# EAGLE schematic Utable_epaper_32seg_rev2 (EAGLE 6.5.0)
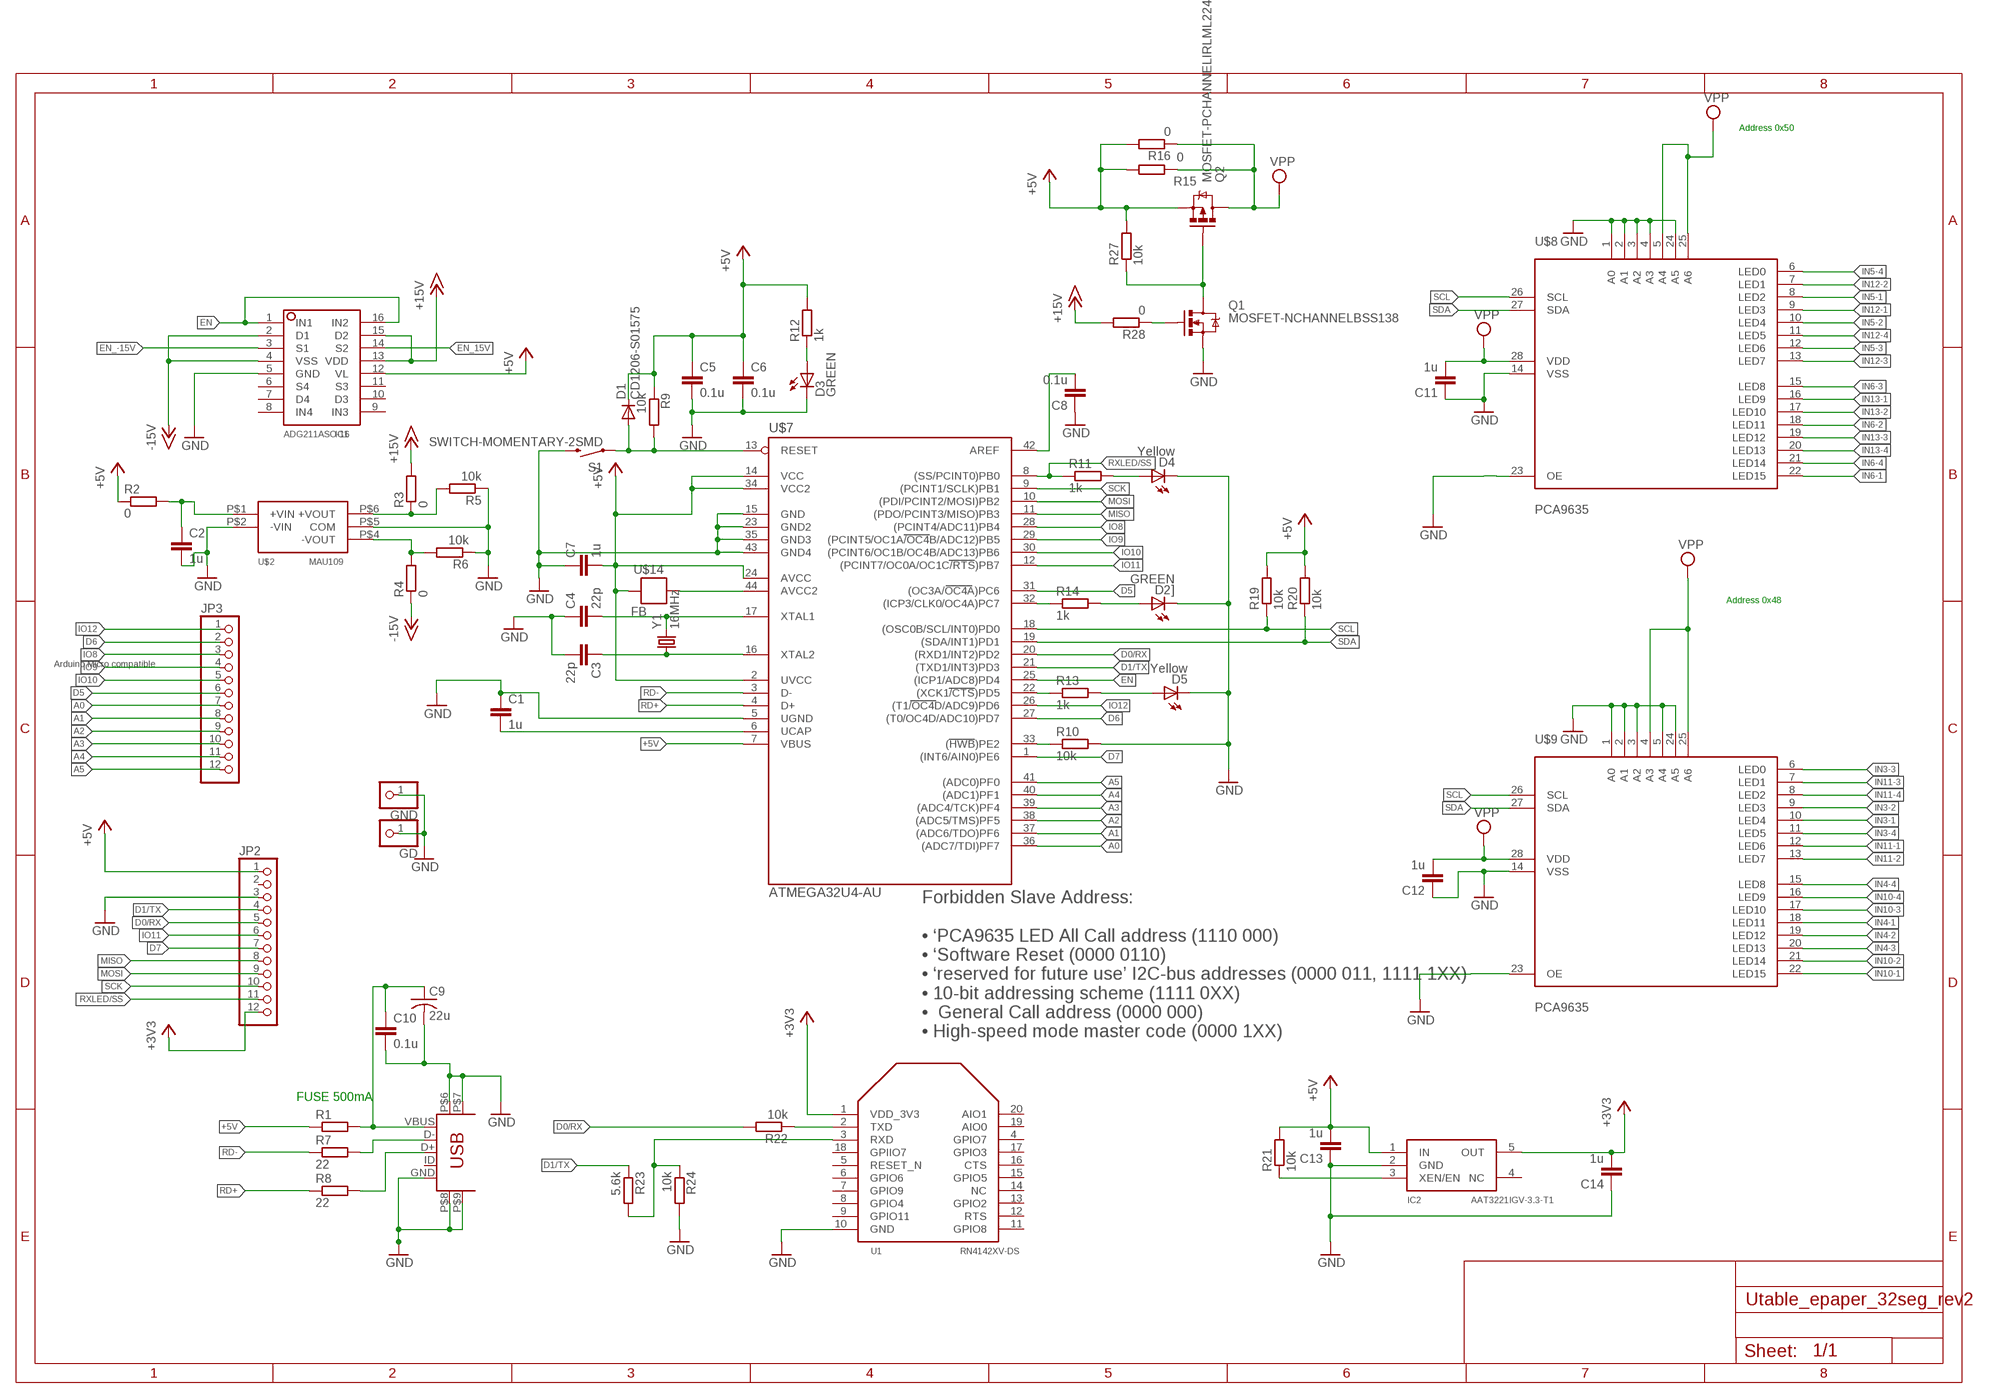
[diagram p0: schematic, sheet 1, part 1 of 2]
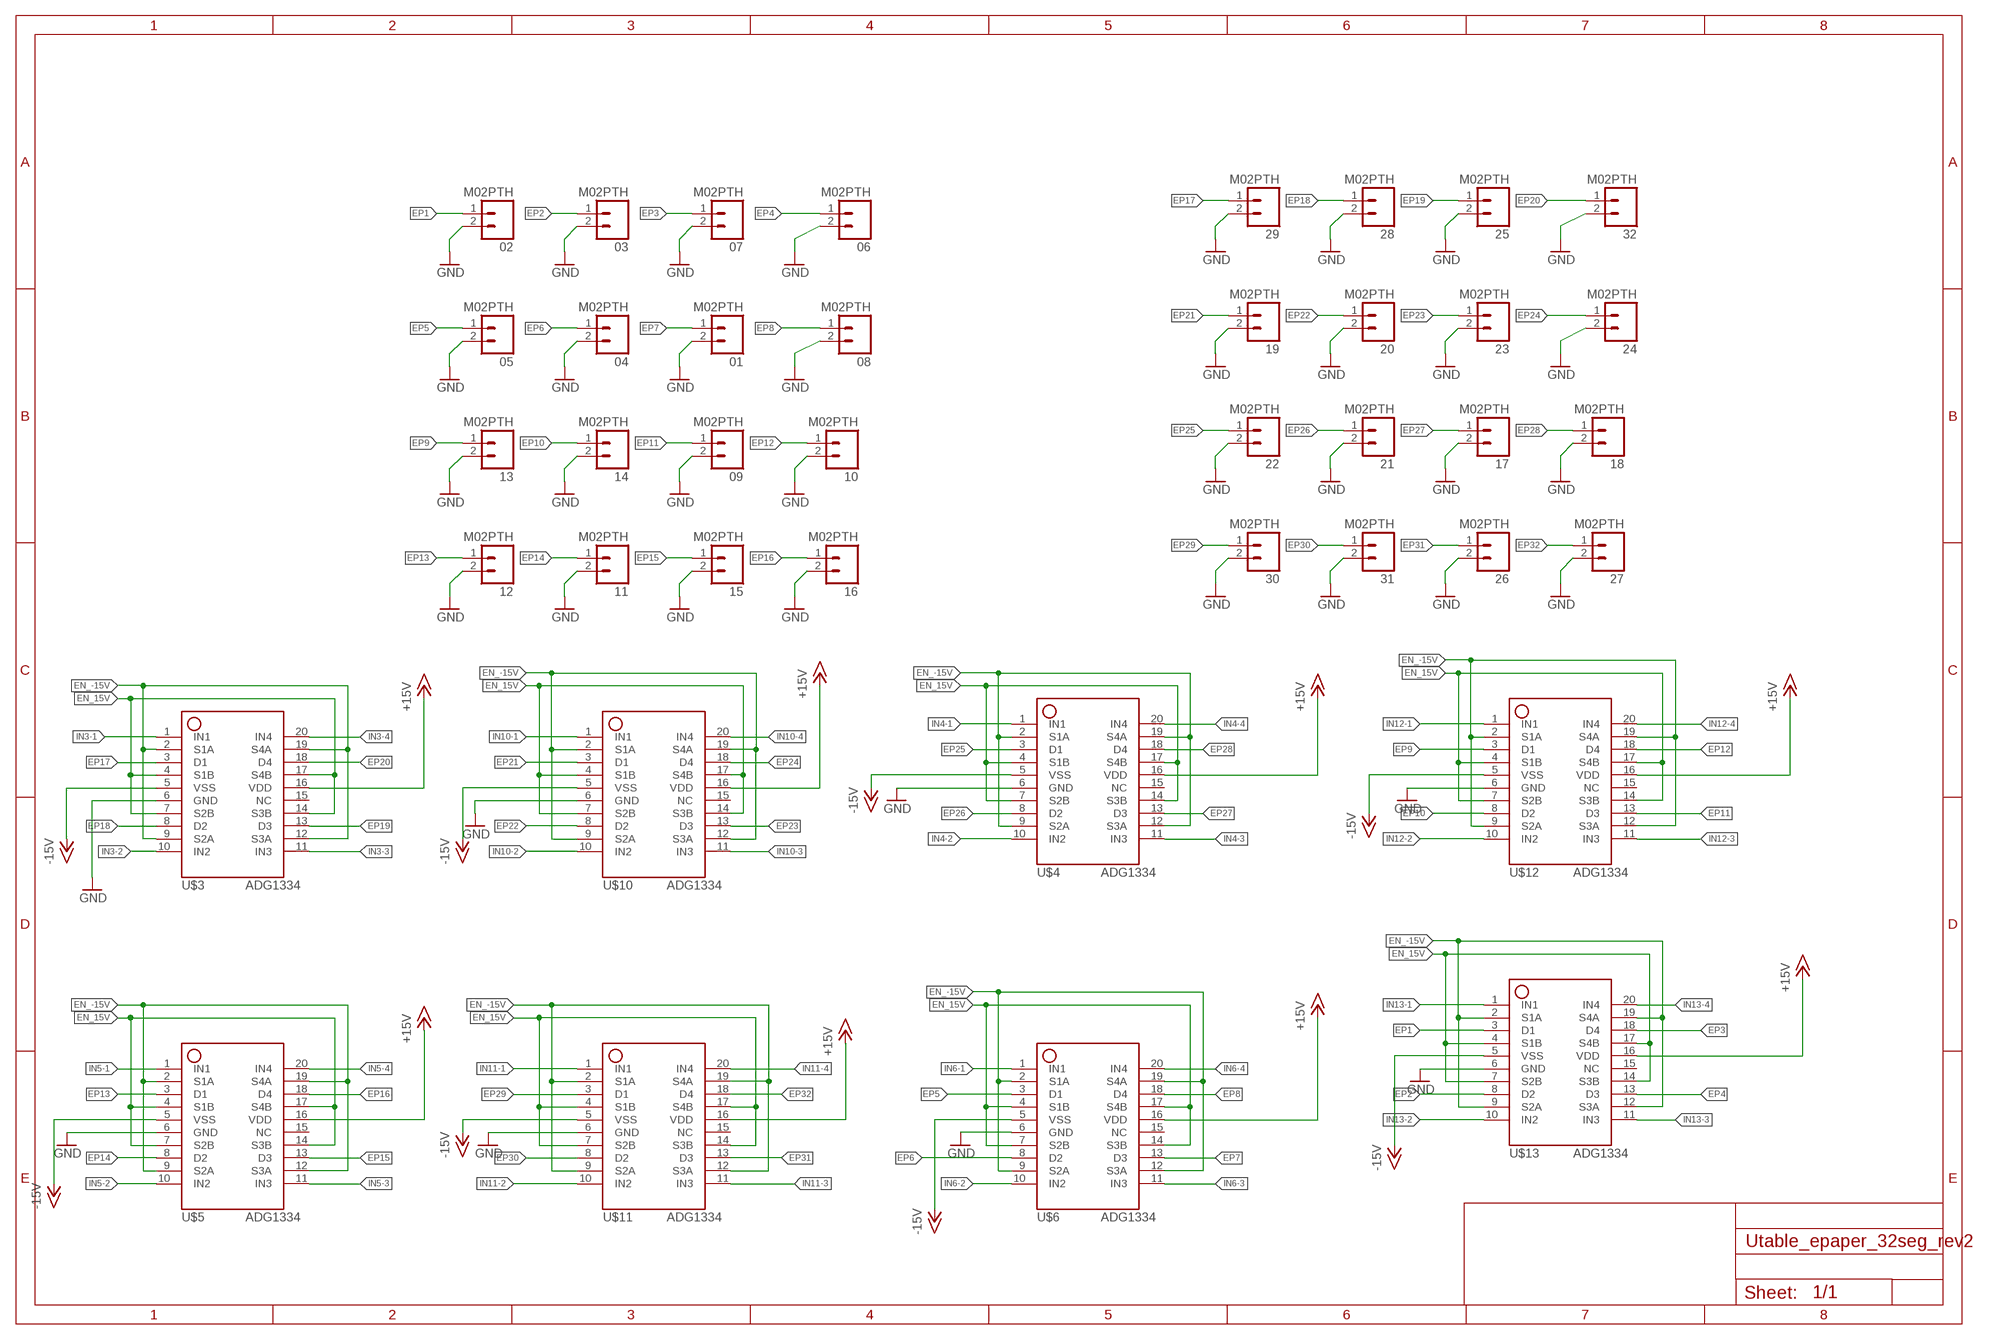
[diagram p1: schematic, sheet 1, part 2 of 2]

## Parts
01  M02PTH  [1X02]
02  M02PTH  [1X02]
03  M02PTH  [1X02]
04  M02PTH  [1X02]
05  M02PTH  [1X02]
06  M02PTH  [1X02]
07  M02PTH  [1X02]
08  M02PTH  [1X02]
09  M02PTH  [1X02]
10  M02PTH  [1X02]
11  M02PTH  [1X02]
12  M02PTH  [1X02]
13  M02PTH  [1X02]
14  M02PTH  [1X02]
15  M02PTH  [1X02]
16  M02PTH  [1X02]
17  M02PTH  [1X02]
18  M02PTH  [1X02]
19  M02PTH  [1X02]
20  M02PTH  [1X02]
21  M02PTH  [1X02]
22  M02PTH  [1X02]
23  M02PTH  [1X02]
24  M02PTH  [1X02]
25  M02PTH  [1X02]
26  M02PTH  [1X02]
27  M02PTH  [1X02]
28  M02PTH  [1X02]
29  M02PTH  [1X02]
30  M02PTH  [1X02]
31  M02PTH  [1X02]
32  M02PTH  [1X02]
C1  1u  C-EUC0603K  [C0603K]
C2  1u  C-EUC0603  [C0603]
C3  22p  C-EUC0603K  [C0603K]
C4  22p  C-EUC0603K  [C0603K]
C5  0.1u  C-EUC0603K  [C0603K]
C6  0.1u  C-EUC0603K  [C0603K]
C7  1u  C-EUC0603K  [C0603K]
C8  0.1u  C-EUC0603K  [C0603K]
C9  22u  C-USC0805K  [C0805K]
C10  0.1u  C-EUC0603K  [C0603K]
C11  1u  C-EUC0603K  [C0603K]
C12  1u  C-EUC0603K  [C0603K]
C13  1u  C-EUC0603K  [C0603K]
C14  1u  C-EUC0603K  [C0603K]
D1  CD1206-S01575  [1206]
D2]  GREEN  LED-GREEN0603  [LED-0603]
D3  GREEN  LED-GREEN0603  [LED-0603]
D4  Yellow  LED-YELLOW0603  [LED-0603]
D5  Yellow  LED-YELLOW0603  [LED-0603]
GD  PINHD-1X1  [1X01]
GND  PINHD-1X1  [1X01]
IC1  ADG211ASO-16  [SO-16]
IC2  AAT3221IGV-3.3-T1  [SOT23-5]
JP2  PINHD-1X12  [1X12]
JP3  PINHD-1X12  [1X12]
Q1  MOSFET-NCHANNELBSS138  [SOT23]
Q2  MOSFET-PCHANNELIRLML2244  [SOT23-3]
R1  R-EU_R0603  [R0603]
R2  0  R-EU_R0603  [R0603]
R3  0  R-EU_R0603  [R0603]
R4  0  R-EU_R0603  [R0603]
R5  10k  R-EU_R0603  [R0603]
R6  10k  R-EU_R0603  [R0603]
R7  22  R-EU_R0603  [R0603]
R8  22  R-EU_R0603  [R0603]
R9  10k  R-EU_R0603  [R0603]
R10  10k  R-EU_R0603  [R0603]
R11  1k  R-EU_R0603  [R0603]
R12  1k  R-EU_R0603  [R0603]
R13  1k  R-EU_R0603  [R0603]
R14  1k  R-EU_R0603  [R0603]
R15  0  R-EU_R0603  [R0603]
R16  0  R-EU_R0603  [R0603]
R19  10k  R-EU_R0603  [R0603]
R20  10k  R-EU_R0603  [R0603]
R21  10k  R-EU_R0603  [R0603]
R22  10k  R-EU_R0603  [R0603]
R23  5.6k  R-EU_R0603  [R0603]
R24  10k  R-EU_R0603  [R0603]
R27  10k  R-EU_R0603  [R0603]
R28  0  R-EU_R0603  [R0603]
S1  SWITCH-MOMENTARY-2SMD  [TACTILE-SWITCH-SMD]
U1  RN4142XV-DS  [XBEE]
U$1  USB_MICRO_FCI  [USB_MICRO_FCI]
U$2  MAU109  [MAU109]
U$3  ADG1334  [SSOP20]
U$4  ADG1334  [SSOP20]
U$5  ADG1334  [SSOP20]
U$6  ADG1334  [SSOP20]
U$7  ATMEGA32U4-AU  [TQFP44]
U$8  PCA9635  [PCA9635]
U$9  PCA9635  [PCA9635]
U$10  ADG1334  [SSOP20]
U$11  ADG1334  [SSOP20]
U$12  ADG1334  [SSOP20]
U$13  ADG1334  [SSOP20]
U$14  FB  [0603]
Y1  16MHz  403C11E16M00000  [OSCILLATOR-3225]

## Nets
+3V3: C14.2 IC2.5(OUT) JP2.12 U1.1(VDD_3V3)
+5V: C5.1 C6.1 C7.2 C13.2 D1.2(C) IC1.12(VL) IC2.1(IN) JP2.1 Q2.2(S) R1.1 R2.1 R9.1 R12.2 R15.2 R16.2 R19.2 R20.2 R21.2 R27.2 U$7.2(UVCC) U$7.7(VBUS) U$7.14(VCC) U$7.24(AVCC) U$7.34(VCC2) U$14.2
+15V: IC1.13(VDD) IC1.15(D2) R3.2 R28.2 U$3.16(VDD) U$4.16(VDD) U$5.16(VDD) U$6.16(VDD) U$10.16(VDD) U$11.16(VDD) U$12.16(VDD) U$13.16(VDD)
-15V: IC1.2(D1) IC1.4(VSS) R4.1 U$3.5(VSS) U$4.5(VSS) U$5.5(VSS) U$6.5(VSS) U$10.5(VSS) U$11.5(VSS) U$12.5(VSS) U$13.5(VSS)
A0: JP3.7 U$7.36((ADC7/TDI)PF7)
A1: JP3.8 U$7.37((ADC6/TDO)PF6)
A2: JP3.9 U$7.38((ADC5/TMS)PF5)
A3: JP3.10 U$7.39((ADC4/TCK)PF4)
A4: JP3.11 U$7.40((ADC1)PF1)
A5: JP3.12 U$7.41((ADC0)PF0)
D0/RX: JP2.5 R22.2 U$7.20((RXD1/INT2)PD2)
D1/TX: JP2.4 R23.1 U$7.21((TXD1/INT3)PD3)
D5: JP3.6 U$7.31((OC3A/OC4A)PC6)
D6: JP3.2 U$7.27((T0/OC4D/ADC10)PD7)
D7: JP2.7 U$7.1((INT6/AIN0)PE6)
EN: IC1.1(IN1) IC1.16(IN2) U$7.25((ICP1/ADC8)PD4)
EN_15V: IC1.14(S2) U$3.4(S1B) U$3.7(S2B) U$3.14(S3B) U$3.17(S4B) U$4.4(S1B) U$4.7(S2B) U$4.14(S3B) U$4.17(S4B) U$5.4(S1B) U$5.7(S2B) U$5.14(S3B) U$5.17(S4B) U$6.4(S1B) U$6.7(S2B) U$6.14(S3B) U$6.17(S4B) U$10.4(S1B) U$10.7(S2B) U$10.14(S3B) U$10.17(S4B) U$11.4(S1B) U$11.7(S2B) U$11.14(S3B) U$11.17(S4B) U$12.4(S1B) U$12.7(S2B) U$12.14(S3B) U$12.17(S4B) U$13.4(S1B) U$13.7(S2B) U$13.14(S3B) U$13.17(S4B)
EN_-15V: IC1.3(S1) U$3.2(S1A) U$3.9(S2A) U$3.12(S3A) U$3.19(S4A) U$4.2(S1A) U$4.9(S2A) U$4.12(S3A) U$4.19(S4A) U$5.2(S1A) U$5.9(S2A) U$5.12(S3A) U$5.19(S4A) U$6.2(S1A) U$6.9(S2A) U$6.12(S3A) U$6.19(S4A) U$10.2(S1A) U$10.9(S2A) U$10.12(S3A) U$10.19(S4A) U$11.2(S1A) U$11.9(S2A) U$11.12(S3A) U$11.19(S4A) U$12.2(S1A) U$12.9(S2A) U$12.12(S3A) U$12.19(S4A) U$13.2(S1A) U$13.9(S2A) U$13.12(S3A) U$13.19(S4A)
EP1: 02.1 U$13.3(D1)
EP2: 03.1 U$13.8(D2)
EP3: 07.1 U$13.18(D4)
EP4: 06.1 U$13.13(D3)
EP5: 05.1 U$6.3(D1)
EP6: 04.1 U$6.8(D2)
EP7: 01.1 U$6.13(D3)
EP8: 08.1 U$6.18(D4)
EP9: 13.1 U$12.3(D1)
EP10: 14.1 U$12.8(D2)
EP11: 09.1 U$12.13(D3)
EP12: 10.1 U$12.18(D4)
EP13: 12.1 U$5.3(D1)
EP14: 11.1 U$5.8(D2)
EP15: 15.1 U$5.13(D3)
EP16: 16.1 U$5.18(D4)
EP17: 29.1 U$3.3(D1)
EP18: 28.1 U$3.8(D2)
EP19: 25.1 U$3.13(D3)
EP20: 32.1 U$3.18(D4)
EP21: 19.1 U$10.3(D1)
EP22: 20.1 U$10.8(D2)
EP23: 23.1 U$10.13(D3)
EP24: 24.1 U$10.18(D4)
EP25: 22.1 U$4.3(D1)
EP26: 21.1 U$4.8(D2)
EP27: 17.1 U$4.13(D3)
EP28: 18.1 U$4.18(D4)
EP29: 30.1 U$11.3(D1)
EP30: 31.1 U$11.8(D2)
EP31: 26.1 U$11.13(D3)
EP32: 27.1 U$11.18(D4)
GND: 01.2 02.2 03.2 04.2 05.2 06.2 07.2 08.2 09.2 10.2 11.2 12.2 13.2 14.2 15.2 16.2 17.2 18.2 19.2 20.2 21.2 22.2 23.2 24.2 25.2 26.2 27.2 28.2 29.2 30.2 31.2 32.2 C1.1 C2.2 C3.2 C4.1 C5.2 C6.2 C7.1 C8.1 C9.2 C10.2 C11.1 C12.1 C13.1 C14.1 D2].C D3.C D4.C D5.C GD.1 GND.1 IC1.5(GND) IC2.2(GND) JP2.3 Q1.2(S) R5.1 R6.1 R10.2 R24.2 S1.3 U1.10(GND) U$1.GND U$1.P$6(MTN1) U$1.P$7(MTN2) U$1.P$8(MTN3) U$1.P$9(MTN4) U$2.P$2(-VIN) U$2.P$5(COM) U$3.6(GND) U$4.6(GND) U$5.6(GND) U$6.6(GND) U$7.5(UGND) U$7.15(GND) U$7.23(GND2) U$7.35(GND3) U$7.43(GND4) U$8.1(A0) U$8.2(A1) U$8.3(A2) U$8.4(A3) U$8.14(VSS) U$8.23(OE) U$8.24(A5) U$9.1(A0) U$9.2(A1) U$9.3(A2) U$9.5(A4) U$9.14(VSS) U$9.23(OE) U$9.24(A5) U$10.6(GND) U$11.6(GND) U$12.6(GND) U$13.6(GND)
IN3-1: U$3.1(IN1) U$9.10(LED4)
IN3-2: U$3.10(IN2) U$9.9(LED3)
IN3-3: U$3.11(IN3) U$9.6(LED0)
IN3-4: U$3.20(IN4) U$9.11(LED5)
IN4-1: U$4.1(IN1) U$9.18(LED11)
IN4-2: U$4.10(IN2) U$9.19(LED12)
IN4-3: U$4.11(IN3) U$9.20(LED13)
IN4-4: U$4.20(IN4) U$9.15(LED8)
IN5-1: U$5.1(IN1) U$8.8(LED2)
IN5-2: U$5.10(IN2) U$8.10(LED4)
IN5-3: U$5.11(IN3) U$8.12(LED6)
IN5-4: U$5.20(IN4) U$8.6(LED0)
IN6-1: U$6.1(IN1) U$8.22(LED15)
IN6-2: U$6.10(IN2) U$8.18(LED11)
IN6-3: U$6.11(IN3) U$8.15(LED8)
IN6-4: U$6.20(IN4) U$8.21(LED14)
IN10-1: U$9.22(LED15) U$10.1(IN1)
IN10-2: U$9.21(LED14) U$10.10(IN2)
IN10-3: U$9.17(LED10) U$10.11(IN3)
IN10-4: U$9.16(LED9) U$10.20(IN4)
IN11-1: U$9.12(LED6) U$11.1(IN1)
IN11-2: U$9.13(LED7) U$11.10(IN2)
IN11-3: U$9.7(LED1) U$11.11(IN3)
IN11-4: U$9.8(LED2) U$11.20(IN4)
IN12-1: U$8.9(LED3) U$12.1(IN1)
IN12-2: U$8.7(LED1) U$12.10(IN2)
IN12-3: U$8.13(LED7) U$12.11(IN3)
IN12-4: U$8.11(LED5) U$12.20(IN4)
IN13-1: U$8.16(LED9) U$13.1(IN1)
IN13-2: U$8.17(LED10) U$13.10(IN2)
IN13-3: U$8.19(LED12) U$13.11(IN3)
IN13-4: U$8.20(LED13) U$13.20(IN4)
IO8: JP3.3 U$7.28((PCINT4/ADC11)PB4)
IO9: JP3.4 U$7.29((PCINT5/OC1A/OC4B/ADC12)PB5)
IO10: JP3.5 U$7.30((PCINT6/OC1B/OC4B/ADC13)PB6)
IO11: JP2.6 U$7.12((PCINT7/OC0A/OC1C/RTS)PB7)
IO12: JP3.1 U$7.26((T1/OC4D/ADC9)PD6)
MISO: JP2.8 U$7.11((PDO/PCINT3/MISO)PB3)
MOSI: JP2.9 U$7.10((PDI/PCINT2/MOSI)PB2)
N$1: C9.1 C10.1 R1.2 U$1.VBUS
N$2: C4.2 U$7.17(XTAL1) Y1.P$3
N$3: R7.2 U$1.D-
N$4: R8.2 U$1.D+
N$5: C2.1 R2.2 U$2.P$1(+VIN)
N$6: R3.1 R5.2 U$2.P$6(+VOUT)
N$7: R4.2 R6.2 U$2.P$4(-VOUT)
N$8: C3.1 U$7.16(XTAL2) Y1.P$1
N$9: D1.1(A) R9.2 S1.1 U$7.13(RESET)
N$10: C1.2 U$7.6(UCAP)
N$12: C8.2 U$7.42(AREF)
N$13: D5.A R13.2
N$14: U$7.44(AVCC2) U$14.1
N$15: R13.1 U$7.22((XCK1/CTS)PD5)
N$16: R14.1 U$7.32((ICP3/CLK0/OC4A)PC7)
N$17: D2].A R14.2
N$19: D4.A R11.2
N$20: D3.A R12.1
N$21: R10.1 U$7.33((HWB)PE2)
N$26: R22.1 U1.2(TXD)
N$27: IC2.3(XEN/EN) R21.1
N$28: R23.2 R24.1 U1.3(RXD)
N$29: Q1.3(D) Q2.1(G) R27.1
N$30: Q1.1(G) R28.1
RD+: R8.1 U$7.4(D+)
RD-: R7.1 U$7.3(D-)
RXLED/SS: JP2.11 R11.1 U$7.8((SS/PCINT0)PB0)
SCK: JP2.10 U$7.9((PCINT1/SCLK)PB1)
SCL: R19.1 U$7.18((OSC0B/SCL/INT0)PD0) U$8.26(SCL) U$9.26(SCL)
SDA: R20.1 U$7.19((SDA/INT1)PD1) U$8.27(SDA) U$9.27(SDA)
VPP: C11.2 C12.2 Q2.3(D) R15.1 R16.1 U$8.5(A4) U$8.25(A6) U$8.28(VDD) U$9.4(A3) U$9.25(A6) U$9.28(VDD)
Unconnected: IC1.6(S4) IC1.7(D4) IC1.8(IN4) IC1.9(IN3) IC1.10(D3) IC1.11(S3) IC2.4(NC) JP2.2 U1.4(GPIO7) U1.5(RESET_N) U1.6(GPIO6) U1.7(GPIO9) U1.8(GPIO4) U1.9(GPIO11) U1.11(GPIO8) U1.12(RTS) U1.13(GPIO2) U1.14(NC) U1.15(GPIO5) U1.16(CTS) U1.17(GPIO3) U1.18(GPIIO7) U1.19(AIO0) U1.20(AIO1) U$1.ID U$3.15(NC) U$4.15(NC) U$5.15(NC) U$6.15(NC) U$10.15(NC) U$11.15(NC) U$12.15(NC) U$13.15(NC)

## Notes on the sheet
- Address 0x50
- Address 0x48
- Arduino Micro compatible
- Forbidden Slave Address:
  
  • ‘PCA9635 LED All Call address (1110 000) 
  • ‘Software Reset (0000 0110) 
  • ‘reserved for future use’ I2C-bus addresses (0000 011, 1111 1XX)
  • 10-bit addressing scheme (1111 0XX)
  •  General Call address (0000 000)
  • High-speed mode master code (0000 1XX)
- FUSE 500mA

## Library data of the parts
01-09 10-32 = SparkFun-Connectors:M02: Standard 2-pin 0.1" header. Use with - straight break away headers ( PRT-00116) - right angle break away headers (PRT-00553) - swiss pins (PRT-00743) - machine pins (PRT-00117) - female headers (PRT-00115) Molex polarized connector foot print use with: PRT-08233 with associated crimp pins and housings. 2.54_SCREWTERM for use with PRT-10571. 3.5mm Screw Terminal footprints for PRT-08084 5mm Screw Terminal footprints for use with PRT-08433
C1-C8 C10-C14 = rcl:C-EU: CAPACITOR, European symbol
C9 = rcl:C-US: CAPACITOR, American symbol
D1 = Utable:CD1206-S01575
D2] D3 = SparkFun-LED:LED-GREEN: Various green LEDs Green LEDs used in SFE Production 0603- DIO-00821 LARGE- DIO-00862 LILYPAD- DIO-09910; PROD_ID: DIO-00821
D4 D5 = SparkFun-LED:LED-YELLOW: Yellow SMD LEDs LilyPad 1206- DIO-09909 0603- DIO-09003; PROD_ID: DIO-09003
GD GND = pinhead:PINHD-1X1: PIN HEADER
IC1 = Utable:ADG211A
IC2 = Utable:AAT3221IGV-3.3-T1
JP2 JP3 = pinhead:PINHD-1X12: PIN HEADER
Q1 = SparkFun-DiscreteSemi:MOSFET-NCHANNEL: Common NMOSFET Parts MFG P/N Store ID Prod ID FDD8780 TRANS-09984 SI7820DN TRANS-11055 FDS6630A IC-08089 2N7002PW TRANS-11151 FQP30N06L COM-10213 TRANS-10060 BSS123LT1G TRANS-08345 BSS138 TRANS-00830 BS170 2N7000; PROD_ID: TRANS-00830
Q2 = SparkFun-DiscreteSemi:MOSFET-PCHANNEL: Generic PMOSFET; PROD_ID: TRANS-11153
R1-R16 R19-R24 R27 R28 = rcl:R-EU_: RESISTOR, European symbol
S1 = SparkFun-Electromechanical:SWITCH-MOMENTARY-2: Various NO switches- pushbuttons, reed, etc
U1 = Utable:RN4142XV-DS
U$1 = Utable:USB_MICRO_FCI
U$2 = Utable:MAU109
U$3-U$6 U$10-U$13 = Utable:ADG1334
U$7 = mega32U4:ATMEGA32U4-AU
U$8 U$9 = NPX PCA9635:PCA9635: 16 pin PWM with 8 bit per-channel PWM, and 7 bit group PWM on I2C bus
U$14 = SparkFun-Passives:FB
Y1 = Utable:403C11E16M00000